# EasyEDA Pro project PicoDucky.epro

# Schematic Schematic1
Board Name: Board1; Create Date: 2025-04-03; Page Name: P1; Project Name: rp2040_neo; Schematic Name: Schematic1; Update Date: 2025-05-02; Company: EasyEDA.com; Page Size: A4; Version: V1.0
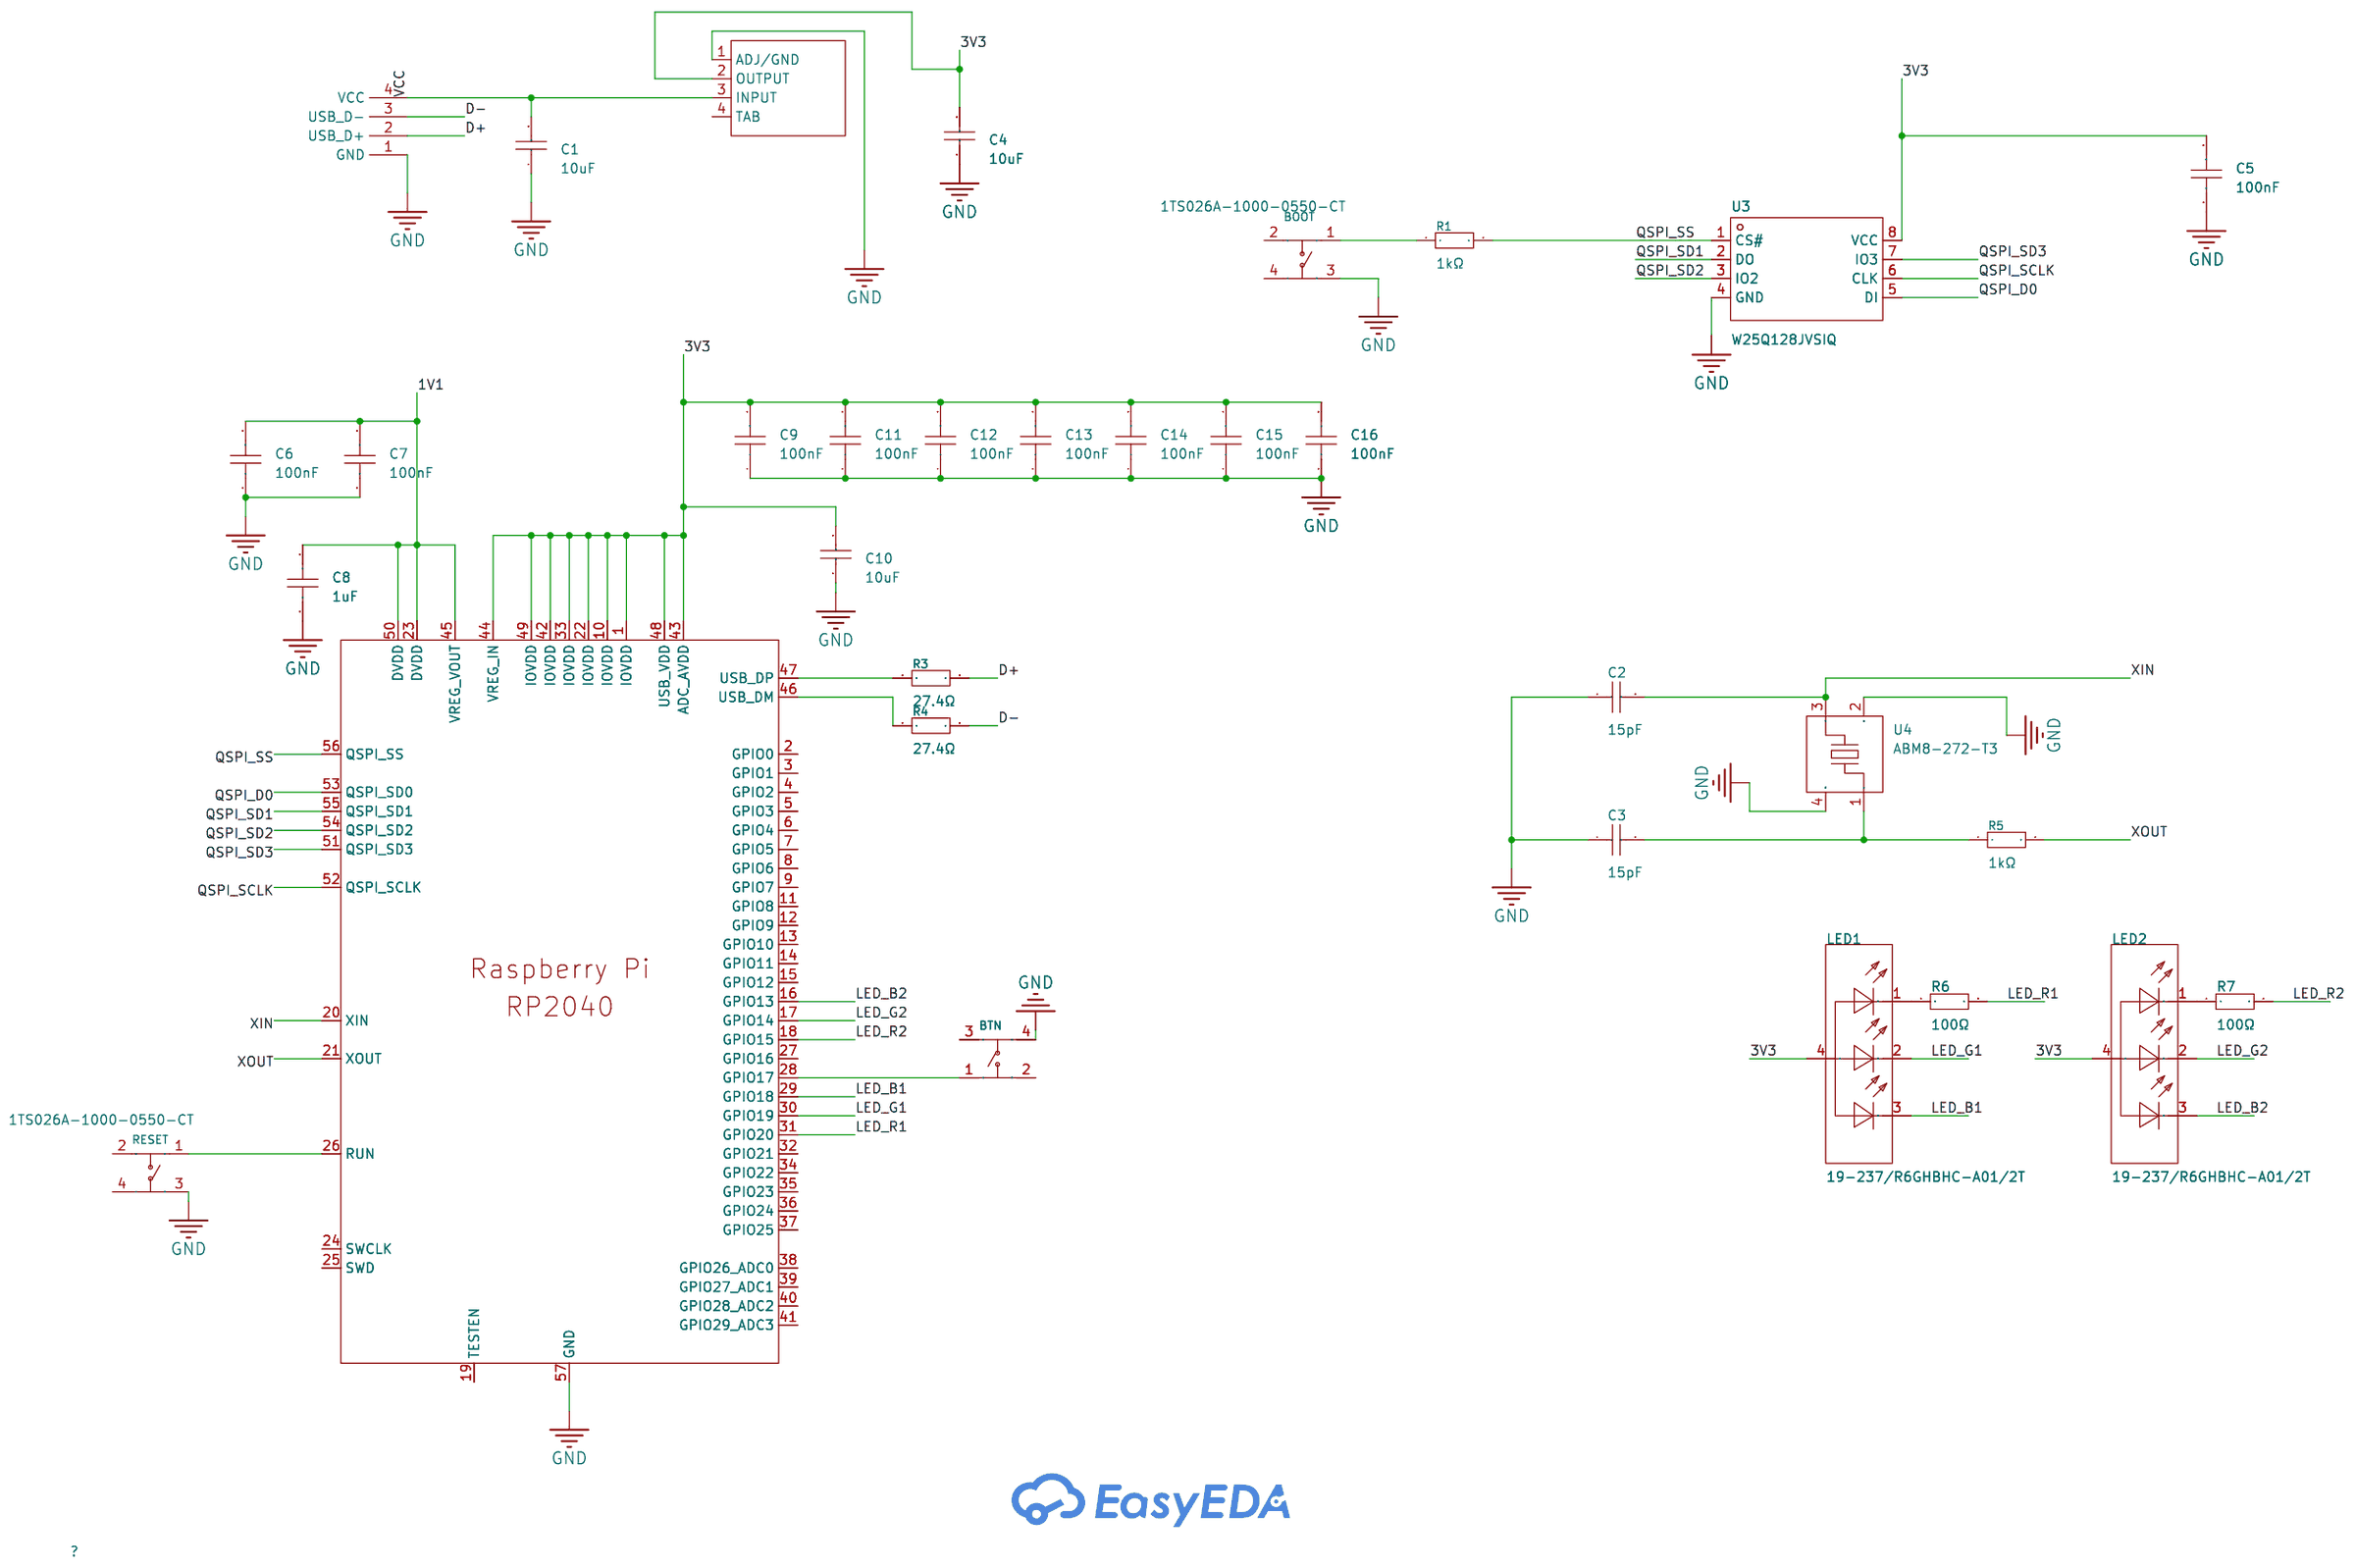
[diagram p0: schematic sheet]

## Parts
BOOT  1TS026A-1000-0550-CT  [SW-SMD_4P-L2.6-W1.6-P0.75-LS3.0]
BTN  1TS026A-1000-0550-CT  [SW-SMD_4P-L2.6-W1.6-P0.75-LS3.0]
C1  10uF  [C0402]
C2  15pF  [C0402]
C3  15pF  [C0402]
C4  10uF  [C0402]
C5  100nF  [C0402]
C6  100nF  [C0402]
C7  100nF  [C0402]
C8  1uF  [C0402]
C9  100nF  [C0402]
C10  10uF  [C0402]
C11  100nF  [C0402]
C12  100nF  [C0402]
C13  100nF  [C0402]
C14  100nF  [C0402]
C15  100nF  [C0402]
C16  100nF  [C0402]
LED1  19-237/R6GHBHC-A01/2T  [LED-ARRAY-SMD_4P-L1.6-W1.6-BL-CW]
LED2  19-237/R6GHBHC-A01/2T  [LED-ARRAY-SMD_4P-L1.6-W1.6-BL-CW]
R1  1kΩ  [R0402]
R3  27.4Ω  [R0402]
R4  27.4Ω  [R0402]
R5  1kΩ  [R0402]
R6  100Ω  [R0402]
R7  100Ω  [R0402]
RESET  1TS026A-1000-0550-CT  [SW-SMD_4P-L2.6-W1.6-P0.75-LS3.0]
U1  RP2040  [LQFN-56_L7.0-W7.0-P0.4-EP]
U2  NCP1117ST33T3G  [SOT-223-3_L6.5-W3.4-P2.30-LS7.0-BR]
U3  W25Q128JVSIQ  [SOIC-8_L5.3-W5.3-P1.27-LS8.0-BL]
U4  ABM8-272-T3  [CRYSTAL-SMD_4P-L3.2-W2.5-BL]
X1  -  [USBA_PCB]

## Library data of the parts
BOOT BTN RESET = 1TS026A-1000-0550-CT: Circuit:SPST Actuator Style:Round Button Operating Force:100gf Mounting Style:Brick nogging Switch Length:2.6mm Switch Width:1.6mm Switch Height:0.55mm Strike Gundam:不带 Contact Current:50mA Voltage Rating (DC):12V Power Rating:0.6W Insulation Resistance:1; LCSC Part Name: 2.6*1.6*0.55mm 立贴 轻触开关; Supplier Part: C913778; Manufacturer: HYP(鸿源精密); Supplier Footprint: SMD,1.6x2.6mm; JLCPCB Part Class: Extended Part; Datasheet: https://atta.szlcsc.com/upload/public/pdf/source/20210419/C913791_AF3AAAEB1C89AA41BE379EDBB7CBA7E3.pdf; Supplier: LCSC; Circuit: SPST; Actuator Style: Round Button; Operating Force: 100gf; Mounting Style: Brick nogging; Switch Length: 2.6mm; Switch Width: 1.6mm; Switch Height: 0.55mm; Strike Gundam: 不带; Contact Current: 50mA; Voltage Rating (DC): 12V; Power Rating: 0.6W; Insulation Resistance: 100MΩ; Actuator/Cap Color: Black; With Lamp: No; IP Rating: IP68; Pin Style: SMDSplicing; Mechanical Life: 20万次; Operating Temperature: -40℃~+90℃
C1 C4 C10 = CL05A106MQ5NUNC: Capacitance: Tolerance:±20% Tolerance:±20% Voltage Rated: Temperature Coefficient:; LCSC Part Name: 10uF ±20% 6.3V; Supplier Part: C15525; Manufacturer: SAMSUNG(三星); Supplier Footprint: 0402; Datasheet: https://atta.szlcsc.com/upload/public/pdf/source/20220823/2B02EE04F8F211D38A52DCB16EB6BEBA.pdf; Supplier: LCSC; Tolerance: ±20%
C2 C3 = 0402CG150J500NT: Capacitance: Tolerance:±5% Tolerance:±5% Voltage Rated: Temperature Coefficient:; LCSC Part Name: 15pF ±5% 50V; Supplier Part: C1548; Manufacturer: FH(风华); Supplier Footprint: 0402; JLCPCB Part Class: Basic Part; Datasheet: https://atta.szlcsc.com/upload/public/pdf/source/20200305/C486355_26A10D38EF8C2A5C37091D0039909270.pdf; Supplier: LCSC; Tolerance: ±5%
C5-C7 C9 C11-C16 = CL05B104KO5NNNC: Capacitance: Tolerance:±10% Tolerance:±10% Voltage Rated: Temperature Coefficient:; LCSC Part Name: 100nF ±10% 16V; Supplier Part: C1525; Manufacturer: SAMSUNG(三星); Supplier Footprint: 0402; JLCPCB Part Class: Basic Part; Datasheet: https://atta.szlcsc.com/upload/public/pdf/source/20160218/1457707763339.pdf; Supplier: LCSC; Tolerance: ±10%
C8 = CL05A105KA5NQNC: Capacitance: Tolerance:±10% Tolerance:±10% Voltage Rated: Temperature Coefficient:; LCSC Part Name: 1uF ±10% 25V; Supplier Part: C52923; Manufacturer: SAMSUNG(三星); Supplier Footprint: 0402; JLCPCB Part Class: Basic Part; Datasheet: https://atta.szlcsc.com/upload/public/pdf/source/20160218/1457707763339.pdf; Supplier: LCSC; Tolerance: ±10%
LED1 LED2 = 19-237/R6GHBHC-A01/2T: Supplier Part: C60105; Manufacturer: EVERLIGHT(亿光); Supplier Footprint: 0606; Datasheet: https://atta.szlcsc.com/upload/public/pdf/source/20151126/1457707591998.pdf; Supplier: LCSC
R1 R5 = 0402WGF1001TCE: Type:Thick Film Resistors Resistance:1kΩ Tolerance:±1% Tolerance:±1% Power(Watts): Overload Voltage (Max): Temperature Coefficient:±100ppm/℃ Temperature Coefficient:±100ppm/℃ Operating Temperature Range:-55℃~+155℃ Operating Temperature Range:-55℃~+155℃; LCSC Part Name: 1kΩ ±1% 62.5mW 厚膜电阻; Supplier Part: C11702; Manufacturer: UNI-ROYAL(厚声); Supplier Footprint: 0402; Datasheet: https://atta.szlcsc.com/upload/public/pdf/source/20200306/C422600_1E6D84923E4A46A82E41ADD87F860B5C.pdf; Supplier: LCSC; Type: Thick Film Resistors; Tolerance: ±1%; Temperature Coefficient: ±100ppm/℃; Operating Temperature Range: -55℃~+155℃
R3 R4 = 0402WGF274JTCE: Type:Thick Film Resistors Resistance:27.4Ω Tolerance:±1% Tolerance:±1% Power(Watts): Overload Voltage (Max): Temperature Coefficient:±100ppm/℃ Temperature Coefficient:±100ppm/℃ Operating Temperature Range:-55℃~+155℃ Operating Temperature Range:-55℃~+155℃; LCSC Part Name: 27.4Ω ±1% 62.5mW 厚膜电阻; Supplier Part: C31439; Manufacturer: UNI-ROYAL(厚声); Supplier Footprint: 0402; JLCPCB Part Class: Extended Part; Datasheet: https://atta.szlcsc.com/upload/public/pdf/source/20200306/C422600_1E6D84923E4A46A82E41ADD87F860B5C.pdf; Supplier: LCSC; Type: Thick Film Resistors; Tolerance: ±1%; Temperature Coefficient: ±100ppm/℃; Operating Temperature Range: -55℃~+155℃
R6 R7 = 0402WGF1000TCE: Type:Thick Film Resistors Resistance: Tolerance:±1% Tolerance:±1% Power(Watts): Overload Voltage (Max): Temperature Coefficient:±200ppm/℃ Temperature Coefficient:±200ppm/℃ Operating Temperature Range:-55℃~+155℃ Operating Temperature Range:-55℃~+155℃; LCSC Part Name: 100Ω ±1% 62.5mW 厚膜电阻; Supplier Part: C25076; Manufacturer: UNI-ROYAL(厚声); Supplier Footprint: 0402; JLCPCB Part Class: Basic Part; Datasheet: https://atta.szlcsc.com/upload/public/pdf/source/20200306/C422600_1E6D84923E4A46A82E41ADD87F860B5C.pdf; Supplier: LCSC; Type: Thick Film Resistors; Tolerance: ±1%; Temperature Coefficient: ±200ppm/℃; Operating Temperature Range: -55℃~+155℃
U1 = RP2040: Supplier Part: C2040; Manufacturer: Raspberry Pi(树莓派); Supplier Footprint: QFN-56-EP(7x7); Datasheet: https://atta.szlcsc.com/upload/public/pdf/source/20220208/8D54DD1C91A7987165C42A5C4D6BB336.pdf; Supplier: LCSC
U2 = NCP1117ST33T3G: Output Type:Fixed Maximum Input Voltage:20V Output Voltage:3.3V Output Voltage:3.3V Output Current:1A Power Supply Rejection Ratio (PSRR):64dB@(120Hz) Dropout Voltage:1.2V@(800mA) standby current:10mA Feature:ESD Protection；Thermal Protection(TSD)；Overcur; LCSC Part Name: 输入20V 输出3.3V 1A; Supplier Part: C26537; Manufacturer: onsemi(安森美); Supplier Footprint: SOT-223-3; JLCPCB Part Class: Extended Part; Datasheet: https://atta.szlcsc.com/upload/public/pdf/source/20241112/E4294CAD03657F5611816BB13648BD42.pdf; Supplier: LCSC; Output Type: Fixed; Maximum Input Voltage: 20V; Output Voltage: 3.3V; Output Current: 1A; Power Supply Rejection Ratio (PSRR): 64dB@(120Hz); Dropout Voltage: 1.2V@(800mA); standby current: 10mA; Feature: ESD Protection；Thermal Protection(TSD)；Overcurrent Protection(OCP); Operating Temperature: 0℃~+125℃; Output Polarity: Positive electrode; Number of Outputs: 1
U3 = W25Q128JVSIQ: Interface Type:SPI Memory Size:128Mbit Clock Frequency (fc):133MHz Supply Voltage:2.7V~3.6V Supply Voltage:2.7V~3.6V Page Programming Time (Tpp):700us Block Erase Time (tBE):120ms@(32KB) Data Retention - TDR (Year):20 years Operating Temperature:-40℃~+85℃; LCSC Part Name: W25Q128JVSIQ 编带; Supplier Part: C97521; Manufacturer: WINBOND(华邦); Supplier Footprint: SOIC-8-208mil; JLCPCB Part Class: Basic Part; Datasheet: https://atta.szlcsc.com/upload/public/pdf/source/20170316/1489627409956.pdf; Supplier: LCSC; Interface Type: SPI; Memory Size: 128Mbit; Clock Frequency (fc): 133MHz; Supply Voltage: 2.7V~3.6V; Page Programming Time (Tpp): 700us; Block Erase Time (tBE): 120ms@(32KB); Data Retention - TDR (Year): 20 years; Operating Temperature: -40℃~+85℃
U4 = ABM8-272-T3_C20625731: Supplier Part: C20625731; Manufacturer: ABRACON; Supplier Footprint: SMD3225-4P; JLCPCB Part Class: Extended Part; Datasheet: https://atta.szlcsc.com/upload/public/pdf/source/20240227/A8BE43F636D80F75C9AF5C59EDF21E9A.pdf; Supplier: LCSC
X1 = USBA_PCB: USB-A PCB

## Nets
1V1: C6.2 C7.2 C8.2 U1.23(DVDD) U1.45(VREG_VOUT) U1.50(DVDD)
3V3: C4.2 C5.2 C9.2 C10.2 C11.2 C12.2 C13.2 C14.2 C15.2 C16.2 LED1.4(+) LED2.4(+) U1.1(IOVDD) U1.10(IOVDD) U1.22(IOVDD) U1.33(IOVDD) U1.42(IOVDD) U1.43(ADC_AVDD) U1.44(VREG_IN) U1.48(USB_VDD) U1.49(IOVDD) U2.2(OUTPUT) U3.8(VCC)
GND: BOOT.3 BTN.4 C1.1 C2.1 C3.1 C4.1 C5.1 C6.1 C7.1 C8.1 C9.1 C10.1 C11.1 C12.1 C13.1 C14.1 C15.1 C16.1 RESET.3 U1.57(GND) U2.1(ADJ/GND) U3.4(GND) U4.2(GND) U4.4(GND) X1.1(GND)
VCC: C1.2 U2.3(INPUT) X1.4(VCC)
D+: R3.2 X1.2(USB_D+)
D-: R4.2 X1.3(USB_D-)
LED_B1: LED1.3(B-) U1.29(GPIO18)
LED_B2: LED2.3(B-) U1.16(GPIO13)
LED_G1: LED1.2(G-) U1.30(GPIO19)
LED_G2: LED2.2(G-) U1.17(GPIO14)
LED_R1: R6.2 U1.31(GPIO20)
LED_R2: R7.2 U1.18(GPIO15)
QSPI_D0: U1.53(QSPI_SD0) U3.5(DI)
QSPI_SCLK: U1.52(QSPI_SCLK) U3.6(CLK)
QSPI_SD1: U1.55(QSPI_SD1) U3.2(DO)
QSPI_SD2: U1.54(QSPI_SD2) U3.3(IO2)
QSPI_SD3: U1.51(QSPI_SD3) U3.7(IO3)
QSPI_SS: R1.2 U1.56(QSPI_SS) U3.1(CS#)
XIN: C2.2 U1.20(XIN) U4.3
XOUT: R5.2 U1.21(XOUT)
$1N2148: R3.1 U1.47(USB_DP)
$1N2152: R4.1 U1.46(USB_DM)
$1N3256: BOOT.1 R1.1
$1N3532: C3.2 R5.1 U4.1
$1N3700: RESET.1 U1.26(RUN)
$1N4645: BTN.1 U1.28(GPIO17)
$1N18829: LED1.1(R-) R6.1
$1N18831: LED2.1(R-) R7.1

Not connected (* = marked no-connect by the designer): BOOT 2 4; BTN 2 3; RESET 2 4; U1 2(GPIO0) 3(GPIO1) 4(GPIO2) 5(GPIO3) 6(GPIO4) 7(GPIO5) 8(GPIO6) 9(GPIO7) 11(GPIO8) 12(GPIO9) 13(GPIO10) 14(GPIO11) 15(GPIO12) 19(TESTEN) 24(SWCLK) 25(SWD) 27(GPIO16) 32(GPIO21) 34(GPIO22) 35(GPIO23) 36(GPIO24) 37(GPIO25) 38(GPIO26_ADC0) 39(GPIO27_ADC1) 40(GPIO28_ADC2) 41(GPIO29_ADC3); U2 4(TAB)

# Board PCB1_1
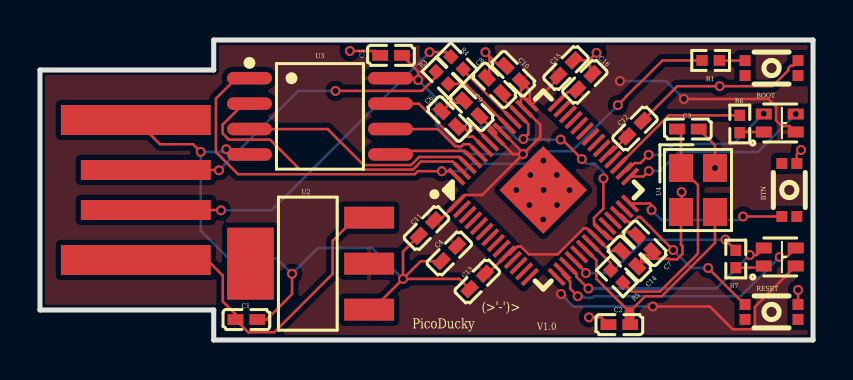
[diagram p1: board, top side]
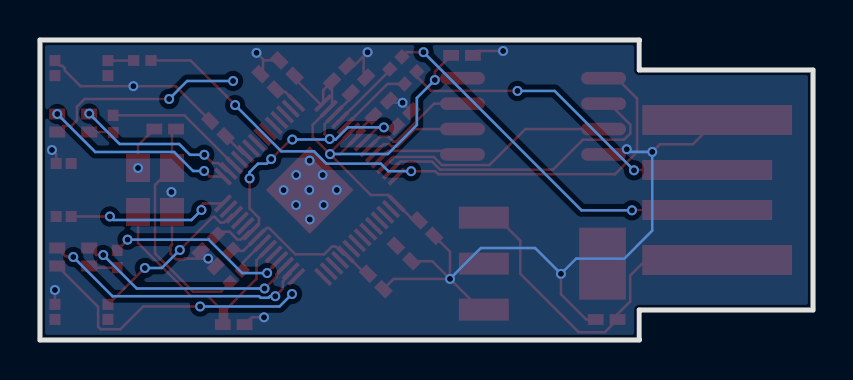
[diagram p2: board, bottom side, seen from below]

Outline 38.7 x 15 mm; copper layers: Top Layer, Bottom Layer. Coordinates in mm from the lower left corner of the outline.
Outline path: 0,13.5 0,1.5 8.7,1.5 8.7,0 38.7,0 38.7,15 8.7,15 8.7,13.5 0,13.5
Stack: Top Layer 0.035mm / Dielectric1 1.51mm FR4 er 4.5 / Bottom Layer 0.035mm

## Design rules (mm)
template: JLCPCB Capability(Two Layers Board)
spacing copperThickness1oz (default): track to track 0.102, other pairs 0.152 to 0.3
spacing copperThickness2oz: track to track 0.203, other pairs 0.152 to 0.3
track width copperThickness1oz (default): min 0.127, default 0.254, max 2.54
track width copperThickness2oz: min 0.203, default 0.254, max 2.54
differential pair differentialPair (default): width min 0.127, default 0.254, max 2.54; gap min 0.152, default 0.152
via viaSize (default): diameter min 0.5, default 0.61, max 10; hole min 0.3, default 0.305, max 6.3

## Placement (name value [footprint] x y rotation side)
BOOT  1TS026A-1000-0550-CT  [SW-SMD_4P-L2.6-W1.6-P0.75-LS3.0]  36.62 13.6 0 top
BTN  1TS026A-1000-0550-CT  [SW-SMD_4P-L2.6-W1.6-P0.75-LS3.0]  37.51 7.5 90 top
C1  10uF  [C0402]  10.33 1.02 180 top
C2  15pF  [C0402]  29 0.77 0 top
C3  15pF  [C0402]  32.43 10.55 180 top
C4  10uF  [C0402]  20.49 4.32 45 top
C5  100nF  [C0402]  17.57 14.23 0 top
C6  100nF  [C0402]  20.49 11.06 315 top
C7  100nF  [C0402]  30.27 4.83 135 top
C8  1uF  [C0402]  22.75 12.73 315 top
C9  100nF  [C0402]  21.61 11.59 315 top
C10  10uF  [C0402]  23.69 13.32 315 top
C11  100nF  [C0402]  19.35 5.59 45 top
C12  100nF  [C0402]  29.79 10.57 225 top
C13  100nF  [C0402]  21.89 2.93 45 top
C14  100nF  [C0402]  29.51 4.07 135 top
C15  100nF  [C0402]  26.34 13.6 225 top
C16  100nF  [C0402]  27.28 12.91 225 top
LED1  19-237/R6GHBHC-A01/2T  [LED-ARRAY-SMD_4P-L1.6-W1.6-BL-CW]  37.03 10.85 0 top
LED2  19-237/R6GHBHC-A01/2T  [LED-ARRAY-SMD_4P-L1.6-W1.6-BL-CW]  37.03 4.15 0 top
R1  1kΩ  [R0402]  33.57 13.98 180 top
R3  27.4Ω  [R0402]  20.14 13.11 135 top
R4  27.4Ω  [R0402]  20.88 13.85 135 top
R5  1kΩ  [R0402]  28.88 3.18 135 top
R6  100Ω  [R0402]  35.03 10.8 90 top
R7  100Ω  [R0402]  34.83 4.05 90 top
RESET  1TS026A-1000-0550-CT  [SW-SMD_4P-L2.6-W1.6-P0.75-LS3.0]  36.62 1.4 0 top
U1  RP2040  [LQFN-56_L7.0-W7.0-P0.4-EP]  25.19 7.5 45 top
U2  NCP1117ST33T3G  [SOT-223-3_L6.5-W3.4-P2.30-LS7.0-BR]  13.51 3.82 0 top
U3  W25Q128JVSIQ  [SOIC-8_L5.3-W5.3-P1.27-LS8.0-BL]  14.02 11.18 270 top
U4  ABM8-272-T3  [CRYSTAL-SMD_4P-L3.2-W2.5-BL]  32.94 7.5 270 top
X1  -  [USBA_PCB]  -0.08 13.85 0 top

## Footprints (pads in the part's own frame, mm; a bottom-side part is the same pattern mirrored in y, then rotated)
C0402
  rect 0.79x0.54 smd: 1(-0.545,0) 2(0.545,0)
CRYSTAL-SMD_4P-L3.2-W2.5-BL
  rect 1.4x1.2 smd: 1(-1.1,-0.85) 2(1.1,-0.85) 3(1.1,0.85) 4(-1.1,0.85)
LED-ARRAY-SMD_4P-L1.6-W1.6-BL-CW
  rect 0.8x0.55 smd: 1(-0.8,-0.45) 2(-0.8,0.45) 3(0.8,0.45) 4(0.8,-0.45)
LQFN-56_L7.0-W7.0-P0.4-EP
  rect 1.1x0.2 smd: 1(-3.55,2.6) 2(-3.55,2.2) 3(-3.55,1.8) 4(-3.55,1.4) 5(-3.55,1) 6(-3.55,0.6) 7(-3.55,0.2) 8(-3.55,-0.2) 9(-3.55,-0.6) 10(-3.55,-1) 11(-3.55,-1.4) 12(-3.55,-1.8) 13(-3.55,-2.2) 14(-3.55,-2.6) 29(3.55,-2.6) 30(3.55,-2.2) 31(3.55,-1.8) 32(3.55,-1.4) 33(3.55,-1) 34(3.55,-0.6) 35(3.55,-0.2) 36(3.55,0.2) 37(3.55,0.6) 38(3.55,1) 39(3.55,1.4) 40(3.55,1.8) 41(3.55,2.2) 42(3.55,2.6)
  rect 0.2x1.1 smd: 15(-2.6,-3.55) 16(-2.2,-3.55) 17(-1.8,-3.55) 18(-1.4,-3.55) 19(-1,-3.55) 20(-0.6,-3.55) 21(-0.2,-3.55) 22(0.2,-3.55) 23(0.6,-3.55) 24(1,-3.55) 25(1.4,-3.55) 26(1.8,-3.55) 27(2.2,-3.55) 28(2.6,-3.55) 43(2.6,3.55) 44(2.2,3.55) 45(1.8,3.55) 46(1.4,3.55) 47(1,3.55) 48(0.6,3.55) 49(0.2,3.55) 50(-0.2,3.55) 51(-0.6,3.55) 52(-1,3.55) 53(-1.4,3.55) 54(-1.8,3.55) 55(-2.2,3.55) 56(-2.6,3.55)
  rect 3.1x3.1 smd: 57(0,0)
R0402
  rect 0.566x0.54 smd: 1(-0.433,0) 2(0.433,0)
SOIC-8_L5.3-W5.3-P1.27-LS8.0-BL
  oval 0.63x2.25 smd: 1(-1.905,-3.53) 2(-0.635,-3.53) 3(0.635,-3.53) 4(1.905,-3.53) 5(1.905,3.53) 6(0.635,3.53) 7(-0.635,3.53) 8(-1.905,3.53)
SOT-223-3_L6.5-W3.4-P2.30-LS7.0-BR
  rect 2.5x1.1 smd: 1(2.97,-2.3) 2(2.97,0) 3(2.97,2.3)
  rect 2.34x3.6 smd: 4(-2.97,0)
SW-SMD_4P-L2.6-W1.6-P0.75-LS3.0
  rect 0.55x0.55 smd: 1(-1.325,0.375) 2(-1.325,-0.375) 3(1.325,0.375) 4(1.325,-0.375)
USBA_PCB
  rect 7.5x1.5 smd: 1(4.88,-2.85) 4(4.88,-9.85)
  rect 6.5x1 smd: 2(5.38,-5.35) 3(5.38,-7.35)

## Nets
As in the schematic.

Pads without a net: BOOT 2 4; BTN 2 3; RESET 2 4; U1 2 3 4 5 6 7 8 9 11 12 13 14 15 19 24 25 27 32 34 35 36 37 38 39 40 41; U2 4

## Via types
v1: diameter 0.5, hole 0.3, Top Layer to Bottom Layer, 55 vias

## Routing (per net, layer and track width the routed paths; a pad name or vN(x,y) marks a point on that pad's centre or on a via; arc(x,y) is an arc through that point)
1V1: length 18.2
  Top Layer w0.127: 22.64,9.77 21.78,10.63 v1(21.48,10.63) 21.45,10.67 C6.2 ; v1(27.12,9.05) 26.15,10.02 v1(26.07,10.02) ; 23.14,12.35 23.14,12.1 24.45,10.79 24.45,10.3 v1(24.2,10.05) ; C7.2 29.69,5.41 29.21,5.41 28.82,5.02 28.64,5.02 28.25,5.41 U1.23 27.73,5.81 27.73,6.1 28.21,6.57 v1(28.21,8.08)
  Bottom Layer w0.127: v1(21.48,10.63) 23.29,10.63 23.9,10.02 v1(26.07,10.02) ; v1(28.21,8.08) 28.21,8.39 27.8,8.8 27.78,8.8 27.76,8.82 27.36,8.82 v1(27.12,9.05)
3V3: length 64.6
  Top Layer w0.127: U1.48 24.18,9.36 v1(24.18,9.29) ; U1.33 28.52,9.3 C12.2 ; U3.8 18.84,13.09 v1(18.93,13) 18.93,13.42 C5.2 ; C15.2 25.95,13.08 24.62,11.75 ; v1(24.18,9.29) 25.05,10.16 25.05,10.75 U1.44 24.08,11.72 24.08,12.93 24.52,12.49 24.52,11.85 ; v1(24.18,9.29) 23.68,9.29 U1.49 22.82,10.38 22,11.2 ; v1(24.18,9.29) 22.13,7.25 21.27,7.25 U1.1 20,5.98 C11.2 ; LED2.4 35.79,1.66 35.79,0.66 35.66,0.54 34.67,0.54 33.53,1.68 v1(30.68,1.68) ; 26.76,12.4 26.41,12.4 25.76,11.75 ; v1(32.23,12.05) 36.46,12.05 36.85,11.66 36.85,10.98 37.13,10.7 37.53,10.7 LED1.4 ; C13.2 22.42,3.31 U1.10 23.51,4.28 23.9,4.67 24.08,4.67 24.47,4.28 25.91,4.28 27.22,5.59 27.35,5.59 27.82,5.13 27.84,5.13 28.52,4.46 C14.2
  Bottom Layer w0.127: v1(30.68,1.68) 26.71,1.68 v1(26.08,2.3) ; v1(29.03,12.95) 31.33,12.95 v1(32.23,12.05) ; v1(24.18,9.29) 24.17,9.3 21.28,9.3 19.83,10.75 19.83,12.1 v1(18.93,13)
GND: length 64.5
  Top Layer w0.127: C1.1 11.35,1.02 12.62,2.29 v1(12.62,3.31) ; v1(18.17,3.05) 19.06,3.94 C4.1 ; v1(18.17,3.05) 16.64,1.52 U2.1 ; v1(18.17,3.05) 18.17,4.42 C11.1 ; v1(18.17,3.05) 20.99,3.05 C13.1 ; U3.4 10.23,9.54 v1(9.32,9.54) ; v1(30.28,4.07) C14.1 ; v1(30.28,4.07) 31.47,4.07 31.51,4.03 31.89,4.03 32.16,4.31 32.16,4.69 32.09,4.77 U4.2 32.12,6.43 v1(32.12,7.4) ; v1(30.28,4.07) C7.1 ; BOOT.3 37.69,13.71 37.58,13.71 37.46,13.58 37.46,13.48 36.67,12.69 v1(34.03,12.69) 31.91,12.69 C12.1 ; C9.1 21.12,11.86 v1(20.55,11.86) 20.13,11.44 C6.1 ; C5.1 16.81,14.45 v1(15.51,14.45) ; C3.1 33.79,9.73 v1(33.79,8.6) ; v1(27.48,1.13) 28.09,1.13 C2.1 ; v1(8.05,9.4) 7.67,9.79 6.01,9.79 X1.1 ; RESET.3 37.95,1.78 v1(37.95,2.5) ; 27.53,14.03 27.48,13.98 C15.1 ; 27.53,14.03 v1(27.86,14.36) ; 27.53,14.03 27.53,13.17 ; 23.31,13.7 22.99,13.7 22.5,14.19 ; 22.5,14.19 v1(22.3,14.39) ; 22.5,14.19 22.5,12.86 ; BTN.4 37.89,9.29 v1(38.1,9.5)
  Bottom Layer w0.127: v1(18.17,3.05) 16.63,4.6 13.91,4.6 v1(12.62,3.31) 11.86,4.07 9.44,4.07 8.05,5.47 v1(8.05,9.4) 9.19,9.4 v1(9.32,9.54)
  vias: v1(23.84,7.5) v1(24.55,8.25) v1(24.5,6.75) v1(25.2,8.97) v1(25.21,7.5) v1(25.19,6.03) v1(25.87,8.25) v1(25.88,6.75) v1(26.5,7.49)
VCC: length 17.4
  Top Layer w0.127: U2.3 15.81,6.12 14.65,4.96 14.65,3.31 11.73,0.39 10.42,0.39 9.79,1.02 9.79,1.29 9.15,1.93 9.15,3.22 8.37,4 X1.4
D+: length 16.7
  Top Layer w0.127: X1.2 8.95,8.5 v1(8.96,8.48) ; R3.2 19.83,13.17 19.12,12.45 v1(14.79,12.45)
  Bottom Layer w0.127: v1(8.96,8.48) 12.93,12.45 v1(14.79,12.45)
D-: length 18.7
  Top Layer w0.127: X1.3 9.05,6.5 v1(9.06,6.48) ; v1(19.5,14.39) 20.33,14.39 20.57,14.16 R4.2
  Bottom Layer w0.127: v1(19.5,14.39) 11.59,6.48 v1(9.06,6.48)
LED_B1: length 9.6
  Top Layer w0.127: v1(30.48,8.45) 30.2,8.17 U1.29
  Bottom Layer w0.127: v1(30.48,8.45) 31.03,8.45 31.98,9.4 35.93,9.4 v1(37.83,11.3)
LED_B2: length 13.5
  Top Layer w0.127: v1(26.92,2.19) 26.54,2.57 26.54,2.92 26.15,3.31 U1.16 ; LED2.3 37.42,4.19 37.34,4.19 37.3,4.15 v1(37.03,4.15)
  Bottom Layer w0.127: v1(37.03,4.15) 35.07,2.19 27.73,2.19 27.65,2.11 27.26,2.11 27.18,2.19 v1(26.92,2.19)
LED_G1: length 8.2
  Top Layer w0.127: v1(30.47,9.26) 30.06,8.85 29.77,8.85 29.38,8.45 29.26,8.45
  Bottom Layer w0.127: v1(36.23,11.32) 34.71,9.8 31.73,9.8 31.19,9.26 v1(30.47,9.26)
LED_G2: length 11.2
  Top Layer w0.127: v1(27.46,2.57) 27.44,2.57 26.86,3.15 26.86,3.28 26.43,3.72 ; v1(35.53,4.25) 35.88,4.25 LED2.2
  Bottom Layer w0.127: v1(35.53,4.25) 33.86,2.57 v1(27.46,2.57)
LED_R1: length 7.1
  Top Layer w0.127: U1.31 31.47,11.23 R6.2
LED_R2: length 9.3
  Top Layer w0.127: U1.18 27.33,3.38 v1(27.33,3.35) ; v1(34.31,5.02) 34.31,5 34.83,4.48
  Bottom Layer w0.127: v1(34.31,5.02) 30.25,5.02 28.58,3.35 v1(27.33,3.35)
QSPI_D0: length 4.5
  Top Layer w0.127: 21.79,8.92 21.26,9.45 17.72,9.45 U3.5
QSPI_SCLK: length 5.2
  Top Layer w0.127: U3.6 19.92,10.55 20.78,9.68 21.1,9.68 21.2,9.79 21.49,9.79 22.08,9.2
QSPI_SD1: length 15.4
  Top Layer w0.127: 21.23,8.35 20.66,8.92 19.07,8.92 18.67,8.52 13.02,8.52 11.52,10.02 9.46,10.02 9.15,10.33 9.15,10.77 10.2,11.82 U3.2
QSPI_SD2: length 12.1
  Top Layer w0.127: U3.3 14.4,10.55 16.2,8.75 18.58,8.75 18.98,9.15 21,9.15 21.51,8.64
QSPI_SD3: length 6
  Top Layer w0.127: U3.7 18.97,11.82 20.88,9.91 21,9.91 21.26,10.17 21.68,10.17 22.36,9.49
QSPI_SS: length 32.8
  Top Layer w0.127: v1(28.93,11.74) 29.34,12.15 29.34,12.17 29.96,12.79 29.98,12.79 31.16,13.98 33.01,13.98 ; U3.1 9.83,13.09 8.81,12.07 8.81,9.39 9.91,8.29 18.77,8.29 18.92,8.44 v1(20.12,8.44) 20.58,8.44 20.94,8.07
  Bottom Layer w0.127: v1(28.93,11.74) 26.62,9.43 24.98,9.43 24.36,8.82 21.63,8.82 21.26,8.44 v1(20.12,8.44)
XIN: length 12
  Top Layer w0.127: U4.3 33.79,4.85 31.13,2.19 30.3,2.19 29.51,1.4 27.86,3.05 27.86,3.98 27.28,4.57
  Top Layer w0.482: 29.51,1.4 29.51,0.81 C2.2
XOUT: length 1.8
  Top Layer w0.127: U1.21 28.57,3.84 R5.2
$1N2148: length 3.8
  Top Layer w0.127: 20.45,12.8 21.3,12.8 U1.47
$1N2152: length 3.7
  Top Layer w0.127: R4.1 21.31,13.42 21.31,13.36 23.77,10.9
$1N3256: length 1.4
  Top Layer w0.127: 33.88,13.98 33.89,13.97 BOOT.1
$1N3532: length 11.4
  Top Layer w0.127: R5.1 29.64,2.42 31.03,2.42 32.94,4.32 32.94,7.75 U4.1 32.09,10.34 C3.2
$1N3700: length 8.4
  Top Layer w0.127: v1(33.45,3.6) 35.27,1.78 RESET.1 ; U1.26 29.1,6.26 29.49,5.87 29.67,5.87 29.95,6.15 30.05,6.15 v1(31.7,4.5)
  Bottom Layer w0.127: v1(33.45,3.6) 32.6,3.6 v1(31.7,4.5)
$1N4645: length 8.2
  Top Layer w0.127: U1.28 30.53,6.83 30.62,6.74 v1(30.62,6.5) ; BTN.1 v1(35.2,6.17)
  Bottom Layer w0.127: v1(30.62,6.5) 31.12,6 35.02,6 v1(35.2,6.17)
$1N18829: length 1.2
  Top Layer w0.127: LED1.1 35.07,10.4 35.03,10.37
$1N18831: length 1.4
  Top Layer w0.127: R7.1 36.15,3.62 LED2.1

## Copper pours and planes (outline as drawn; the poured copper is in the pictures)
3V3 on Top Layer: -1.27,15.8 40.18,15.8 40.18,-1.05 -1.27,-1.05
GND on Bottom Layer: -1.07,16.35 40.38,16.35 40.38,-0.9 -1.07,-0.9

## Text on the board
Top Silkscreen Layer: V1.0 | PicoDucky | (>'-')>
